# EAGLE design Shield-0.6 (EAGLE 7.6.0)
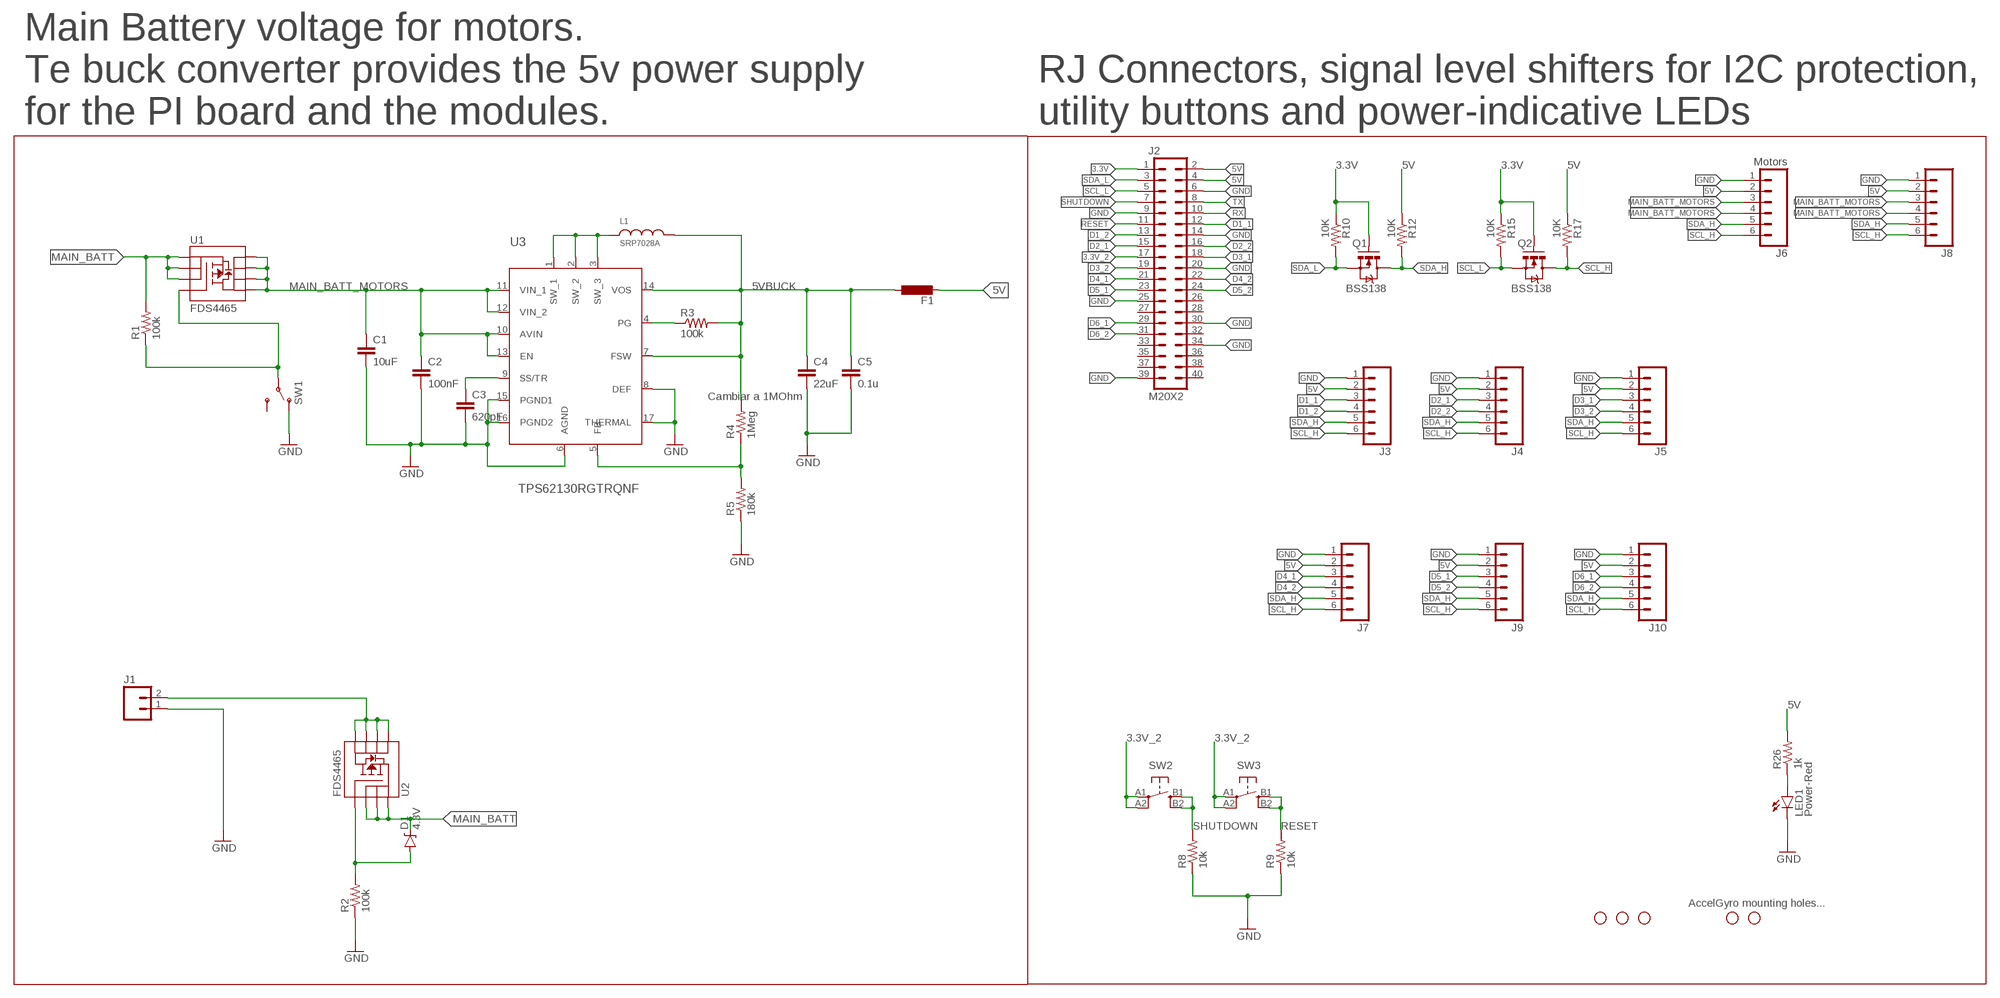
[diagram p0: schematic, sheet 1]

## Parts
C1  10uF  CAP0603-CAP  [0603-CAP]
C2  100nF  CAP0603-CAP  [0603-CAP]
C3  620pF  CAP0603-CAP  [0603-CAP]
C4  22uF  CAP0805  [0805]
C5  0.1u  CAP0603-CAP  [0603-CAP]
D1  4.3V  DIODE-ZENER3.3V  [SOD-323]
F1  L-EUL1812  [L1812]
H1  STAND-OFFPLATED  [STAND-OFF-PLATED]
H2  STAND-OFFPLATED  [STAND-OFF-PLATED]
H3  STAND-OFFNORMAL  [STAND-OFF]
H4  STAND-OFF  [STAND-OFF]
H5  STAND-OFF  [STAND-OFF]
J1  M02PTH-XH  [JST-2-PTH-XH]
J2  M20X2  [2X20]
J3  M06RJ11  [RJ11-6P6C]
J4  M06RJ11  [RJ11-6P6C]
J5  M06RJ11  [RJ11-6P6C]
J6  Motors  M06RJ11  [RJ11-6P6C]
J7  M06RJ11  [RJ11-6P6C]
J8  M06RJ11  [RJ11-6P6C]
J9  M06RJ11-SMD  [RJ11-6P6C-SMD]
J10  M06RJ11-SMD  [RJ11-6P6C-SMD]
L1  SRP7028A  [SRP7028A]
LED1  Power-Red  LED0603  [LED-0603]
Q1  BSS138  MOSFET-NCHANNELSMD  [SOT23-3]
Q2  BSS138  MOSFET-NCHANNELSMD  [SOT23-3]
R1  100k  RESISTOR0603-RES  [0603-RES]
R2  100k  RESISTOR0603-RES  [0603-RES]
R3  100k  RESISTOR0603-RES  [0603-RES]
R4  1Meg  RESISTOR0603-RES  [0603-RES]
R5  180k  RESISTOR0603-RES  [0603-RES]
R8  10k  RESISTOR0603-RES  [0603-RES]
R9  10k  RESISTOR0603-RES  [0603-RES]
R10  10K  RESISTOR0603-RES  [0603-RES]
R12  10K  RESISTOR0603-RES  [0603-RES]
R15  10K  RESISTOR0603-RES  [0603-RES]
R17  10K  RESISTOR0603-RES  [0603-RES]
R26  1k  RESISTOR0603-RES  [0603-RES]
SW1  SWITCH-SPDT-SPDT-TH  [SW-SPDT-TH]
SW2  SWITCH_SPST_4_PINTALL  [TACTILE_SWITCH_TALL]
SW3  SWITCH_SPST_4_PINTALL  [TACTILE_SWITCH_TALL]
U1  FDS4465  MOSFET-PCHANNEL-SOIC8SOIC8  [SO08]
U2  FDS4465  MOSFET-PCHANNEL-SOIC8SOIC8  [SO08]
U3  TPS62130RGTRQNF  [QFN-N16]

## Nets
3.3V: J2.1 Q1.1(G) Q2.1(G) R10.1 R15.1
3.3V_2: J2.17 SW2.A1 SW2.A2 SW3.A1 SW3.A2
5V: F1.2 J2.2 J2.4 J3.2 J4.2 J5.2 J6.2 J7.2 J8.2 J9.2 J10.2 R12.1 R17.1 R26.2
5VBUCK: C4.1 C5.1 F1.1 L1.P$2 R3.2 R4.2 U3.7(FSW) U3.14(VOS)
D1_1: J2.12 J3.3
D1_2: J2.13 J3.4
D2_1: J2.15 J4.3
D2_2: J2.16 J4.4
D3_1: J2.18 J5.3
D3_2: J2.19 J5.4
D4_1: J2.21 J7.3
D4_2: J2.22 J7.4
D5_1: J2.23 J9.3
D5_2: J2.24 J9.4
D6_1: J2.29 J10.3
D6_2: J2.31 J10.4
GND: C1.2 C2.2 C3.2 C4.2 C5.2 J1.1 J2.6 J2.9 J2.14 J2.20 J2.25 J2.30 J2.34 J2.39 J3.1 J4.1 J5.1 J6.1 J7.1 J8.1 J9.1 J10.1 LED1.C R2.1 R5.1 R8.1 R9.1 SW1.P$3(O) U3.6(AGND) U3.8(DEF) U3.15(PGND1) U3.16(PGND2) U3.17(THERMAL)
MAIN_BATT: D1.C R1.2 U1.1(S) U1.2(S) U1.3(S) U2.1(S) U2.2(S) U2.3(S)
MAIN_BATT_MOTORS: C1.1 C2.1 J6.3 J6.4 J8.3 J8.4 U1.5(D) U1.6(D) U1.7(D) U1.8(D) U3.10(AVIN) U3.11(VIN_1) U3.12(VIN_2) U3.13(EN)
MAIN_VBATT: J1.2 U2.5(D) U2.6(D) U2.7(D) U2.8(D)
N$1: C3.1 U3.9(SS/TR)
N$2: L1.P$1 U3.1(SW_1) U3.2(SW_2) U3.3(SW_3)
N$5: R3.1 U3.4(PG)
N$7: R4.1 R5.2 U3.5(FB)
N$15: LED1.A R26.1
N$17: D1.A R2.2 U2.4(G)
N$22: R1.1 SW1.P$2(P) U1.4(G)
RESET: J2.11 R9.2 SW3.B1 SW3.B2
RX: J2.10
SCL_H: J3.6 J4.6 J5.6 J6.6 J7.6 J8.6 J9.6 J10.6 Q2.3(D) R17.2
SCL_L: J2.5 Q2.2(S) R15.2
SDA_H: J3.5 J4.5 J5.5 J6.5 J7.5 J8.5 J9.5 J10.5 Q1.3(D) R12.2
SDA_L: J2.3 Q1.2(S) R10.2
SHUTDOWN: J2.7 R8.2 SW2.B1 SW2.B2
TX: J2.8
Unconnected: J2.26 J2.27 J2.28 J2.32 J2.33 J2.35 J2.36 J2.37 J2.38 J2.40 SW1.P$1(S)

## Notes on the sheet
- Main Battery voltage for motors.
  Te buck converter provides the 5v power supply 
  for the PI board and the modules.
- RJ Connectors, signal level shifters for I2C protection,  
  utility buttons and power-indicative LEDs
- Cambiar a 1MOhm
- AccelGyro mounting holes...

## Library data of the parts
C1-C3 C5 = SparkFun-Capacitors:CAP: Capacitor Standard 0603 ceramic capacitor, and 0.1" leaded capacitor.
C4 = SparkFun-Passives:CAP: Capacitor Standard 0603 ceramic capacitor, and 0.1" leaded capacitor.
D1 = SparkFun-DiscreteSemi:DIODE-ZENER: Zener Diode Production Part - 8199 3.4V Zener Voltage; PROD_ID: DIO-11284; VALUE: 3.3V
F1 = arduino_Uno_Rev3-02-TH:L-EU: INDUCTOR, European symbol
H1-H3 = Robotois:STAND-OFF: #4 Stand Off This is the mechanical footprint for a #4 phillips button head screw. Use the keepout ring to avoid running the screw head into surrounding components. SKU : PRT-00447
H4 H5 = SparkFun-Electromechanical:STAND-OFF: #4 Stand Off This is the mechanical footprint for a #4 phillips button head screw. Use the keepout ring to avoid running the screw head into surrounding components. SKU : PRT-00447
J1 = Robotois:M02: Standard 2-pin 0.1" header. Use with - straight break away headers ( PRT-00116) - right angle break away headers (PRT-00553) - swiss pins (PRT-00743) - machine pins (PRT-00117) - female headers (PRT-00115) Molex polarized connector foot print use with: PRT-08233 with associated crimp pins and housings. 2.54_SCREWTERM for use with PRT-10571. 3.5mm Screw Terminal footprints for PRT-08084 5mm Screw Terminal footprints for use with PRT-08432
J2 = SparkFun-Connectors:M20X2: 0.1" spaced headers
J3-J10 = Robotois:M06: Header 6 Standard 6-pin 0.1" header. Use with straight break away headers (SKU : PRT-00116), right angle break away headers (PRT-00553), swiss pins (PRT-00743), machine pins (PRT-00117), and female headers (PRT-00115). Molex polarized connector foot print use with SKU : PRT-08094 with associated crimp pins and housings. NOTES ON THE VARIANTS LOCK and LOCK_LONGPADS... This footprint was designed to help hold the alignment of a through-hole component (i.e. 6-pin header) while soldering it into place. You may notice that each hole has been shifted either up or down by 0.005 of an inch from it's more standard position (which is a perfectly straight line). This slight alteration caused the pins (the squares in the middle) to touch the edges of the holes. Because they are alternating, it causes a "brace" to hold the component in place. 0.005 has proven to be the perfect amount of "off-center" position when using our standard breakaway headers. Although looks a little odd when you look at the bare footprint, once you have a header in there, the alteration is very hard to notice. Also,if you push a header all the way into place, it is covered up entirely on the bottom side. This idea of altering the position of holes to aid alignment will be further integrated into the Sparkfun Library for other footprints. It can help hold any component with 3 or more connection pins.
L1 = Robotois:SRP7028A: This package is designed on the basis of the fixed inductor SRP7028A from Bourns.
LED1 = SparkFun-LED:LED: LEDs Standard schematic elements and footprints for 5mm, 3mm, 1206, and 0603 sized LEDs. 5mm - Spark Fun Electronics SKU : COM-00529 (and others)
Q1 Q2 = SparkFun:MOSFET-NCHANNEL
R1-R5 R8-R10 R12 R15 R17 R26 = SparkFun-Resistors:RESISTOR: Resistor Basic schematic elements and footprints for 0603, 1206, and PTH resistors.
SW1 = Robotois:SWITCH-SPDT: SPDT Switch Simple slide switch, Spark Fun Electronics SKU : COM-00102 DPDT SMT slide switch, AYZ0202, SWCH-08179
SW2 SW3 = Robotois:SWITCH_SPST_4_PIN
U1 U2 = SparkFun-DiscreteSemi:MOSFET-PCHANNEL-SOIC8: Generic 8-pin PMOSFET
U3 = Robotois:TPS62130RGTR

## Net classes
0 default: clearance 0.203 mm
1 vcc: clearance 0.254 mm

## Board
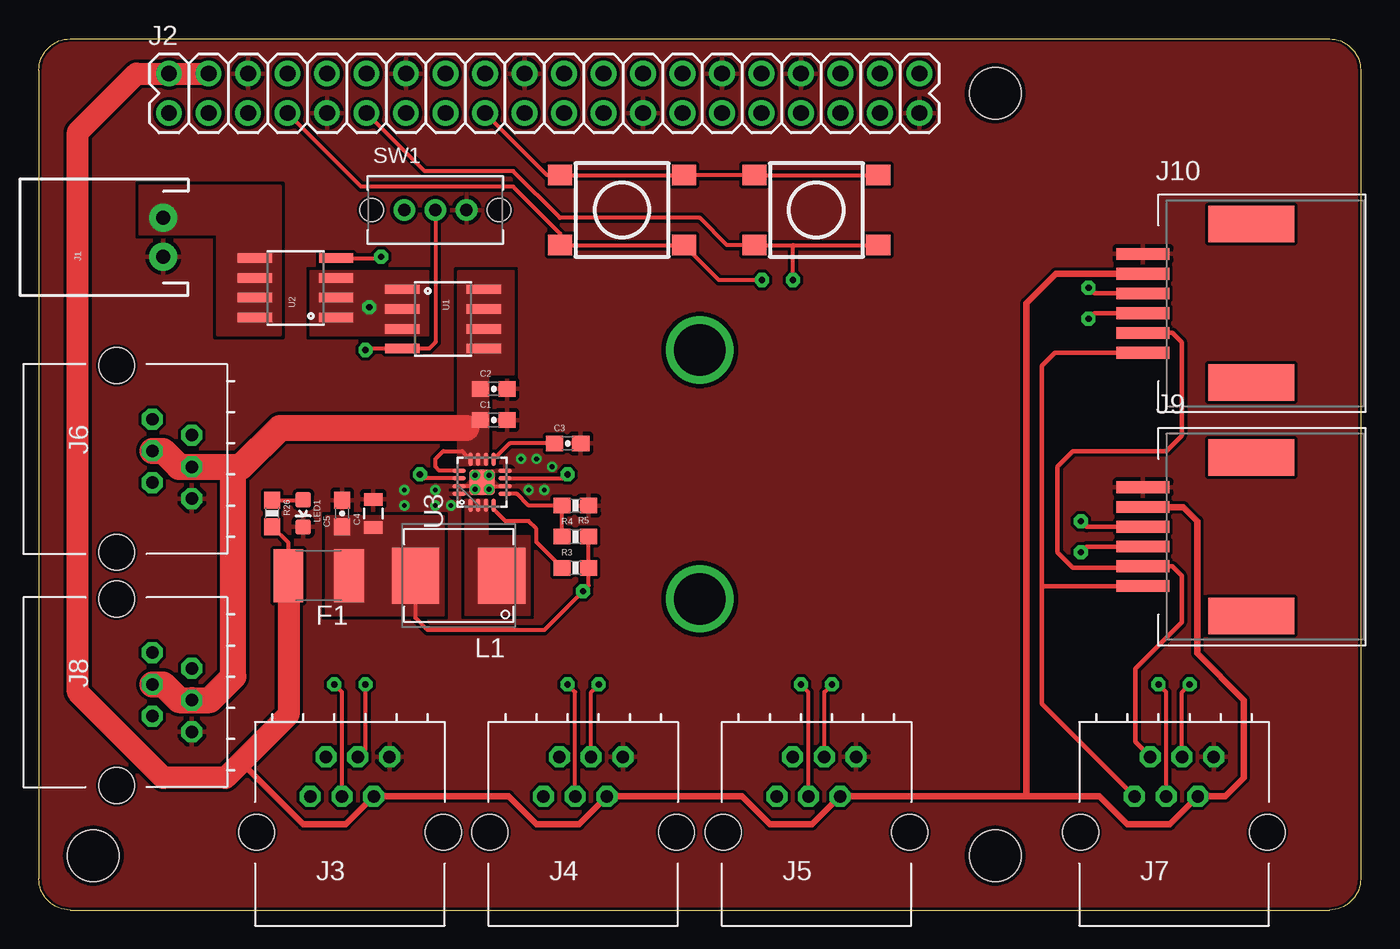
[diagram p1: board, top side]
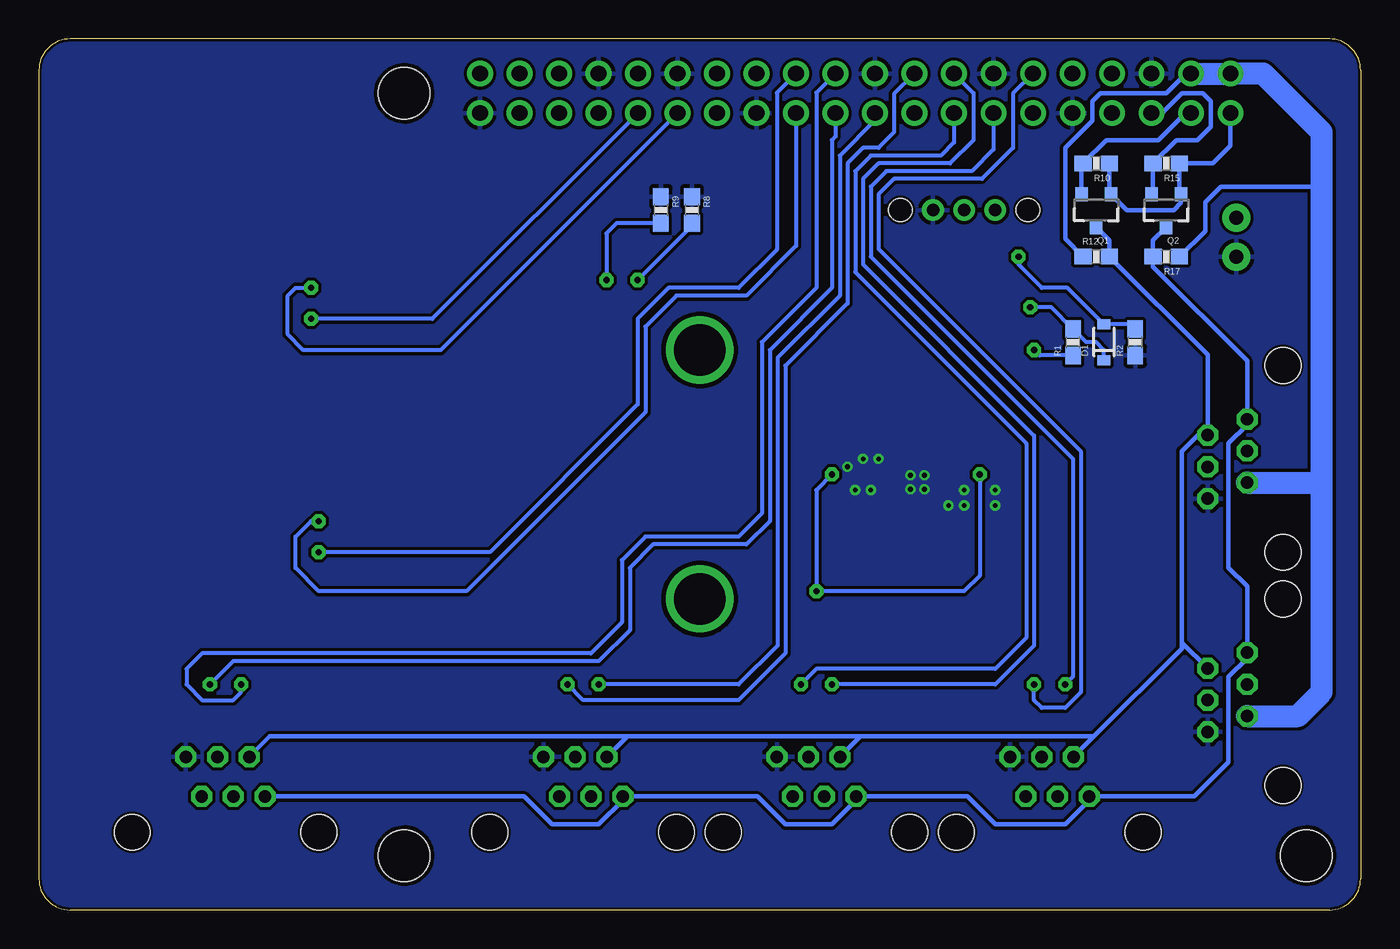
[diagram p2: board, bottom side, seen from below]

Size 85 x 56 mm. Coordinates in mm from the lower left corner, seen from the top.
Outline: 0,54 0,2 arc90 2,0 83,0 arc90 85,2 85,54 arc90 83,56 2,56 arc90 0,54
Copper layers (1*16): Top 0.035mm / dielectric 1.5mm / Bottom 0.035mm
Design rules "SparkFun-2-layer-TIGHT": minimum track width 7mil, minimum drill 15mil, track to track 7mil, track to pad 7mil, pad to pad 7mil, via to via 7mil, smd to smd 7mil, copper to edge 7mil, drill to drill 7mil, minimum pad ring 7mil, minimum via ring 7mil, stop-mask expansion 4mil, vias tented up to drill 25mil, thermal gap 10mil

### Footprints (pad centres in the part's own frame; a part is rotated, then mirrored left to right if it is on the bottom)
0603-CAP = smd 1.1 x 1: 1 -0.85,0; 2 0.85,0
0805 = smd 0.8 x 1.2: 1 -0.9,0; 2 0.9,0
SOD-323 = smd 0.63 x 0.83: A 1.15,0; C -1.15,0
L1812 = smd 1.9 x 3.4: 1 -1.95,0; 2 1.95,0
STAND-OFF-PLATED = drill 3.302: P$1 0,0
STAND-OFF = hole 3.302: 0,0
JST-2-PTH-XH = drill 0.9 pad 1.8: 1 0,0; 2 2.5,0
2X20 = drill 1.016 pad 1.651: 1 -24.13,-1.27; 2 -24.13,1.27; 3 -21.59,-1.27; 4 -21.59,1.27; 5 -19.05,-1.27; 6 -19.05,1.27; 7 -16.51,-1.27; 8 -16.51,1.27; 9 -13.97,-1.27; 10 -13.97,1.27; 11 -11.43,-1.27; 12 -11.43,1.27; 13 -8.89,-1.27; 14 -8.89,1.27; 15 -6.35,-1.27; 16 -6.35,1.27; 17 -3.81,-1.27; 18 -3.81,1.27; 19 -1.27,-1.27; 20 -1.27,1.27; 21 1.27,-1.27; 22 1.27,1.27; 23 3.81,-1.27; 24 3.81,1.27; 25 6.35,-1.27; 26 6.35,1.27; 27 8.89,-1.27; 28 8.89,1.27; 29 11.43,-1.27; 30 11.43,1.27; 31 13.97,-1.27; 32 13.97,1.27; 33 16.51,-1.27; 34 16.51,1.27; 35 19.05,-1.27; 36 19.05,1.27; 37 21.59,-1.27; 38 21.59,1.27; 39 24.13,-1.27; 40 24.13,1.27
RJ11-6P6C = drill 0.8 pad 1.35 octagon: 1 2.55,4.84; 2 1.53,2.3; 3 0.51,4.84; 4 -0.51,2.3; 5 -1.53,4.84; 6 -2.55,2.3 | hole 2.3: -6,0; 6,0
RJ11-6P6C-SMD = smd 3.4 x 0.76: 1 0,3.175; 2 0,1.905; 3 0,0.635; 4 0,-0.635; 5 0,-1.905; 6 0,-3.175 | smd 5.5 x 2.35: SR$1 6.97,5.1; SR$2 6.97,-5.1
SRP7028A = smd 3.05 x 3.6: P$1 -2.775,0; P$2 2.775,0
LED-0603 = smd 1 x 1: A 0,-0.877; C 0,0.877
SOT23-3 = smd 0.8 x 0.9: 1 -0.95,-1; 2 0.95,-1; 3 0,1.1
0603-RES = smd 1.1 x 1: 1 -0.85,0; 2 0.85,0
SW-SPDT-TH = drill 0.8 pad 1.4: P$1 -2,0; P$2 0,0; P$3 2,0 | hole 1.5: -4.1,0; 4.1,0
TACTILE_SWITCH_TALL = smd 1.55 x 1.3: A1 -3.975,-2.25; A2 3.975,-2.25; B1 -3.975,2.25; B2 3.975,2.25
SO08 = smd 0.61 x 2.21: 1 -1.905,-2.616; 2 -0.635,-2.616; 3 0.635,-2.616; 4 1.905,-2.616; 5 1.905,2.616; 6 0.635,2.616; 7 -0.635,2.616; 8 -1.905,2.616
QFN-N16 = smd 0.85 x 0.28: 1 -1.475,0.75; 2 -1.475,0.25; 3 -1.475,-0.25; 4 -1.475,-0.75; 9 1.475,-0.75; 10 1.475,-0.25; 11 1.475,0.25; 12 1.475,0.75 | smd 0.28 x 0.85: 5 -0.75,-1.475; 6 -0.25,-1.475; 7 0.25,-1.475; 8 0.75,-1.475; 13 0.75,1.475; 14 0.25,1.475; 15 -0.25,1.475; 16 -0.75,1.475 | smd 1.65 x 1.65: 17 0,0

### Placement (x,y rotation side)
C1  29.25,31.5 0 top
C2  29.25,33.5 0 top
C3  34,30 0 top
C4  21.5,25.5 90 top
C5  19.5,25.5 90 top
D1  16.5,36.5 90 bottom
F1  18,21.5 180 top
H1  42.5,20 0 top
H2  42.5,36 0 top
H3  61.5,52.5 0 top
H4  3.5,3.5 0 top
H5  61.5,3.5 0 top
J1  8,42 90 top
J2  32.5,52.5 0 top
J3  20,5 0 top
J4  35,5 0 top
J5  50,5 0 top
J6  5,29 270 top
J7  73,5 0 top
J8  5,14 270 top
J9  71,24 0 top
J10  71,39 0 top
L1  27,21.5 180 top
LED1  17,25.5 180 top
Q1  17,45 180 bottom
Q2  12.5,45 180 bottom
R1  18.5,36.5 90 bottom
R2  14.5,36.5 90 bottom
R3  34.5,22 0 top
R4  34.5,24 0 top
R5  34.5,26 180 top
R8  43,45 270 bottom
R9  45,45 270 bottom
R10  17,48 180 bottom
R12  17,42 0 bottom
R15  12.5,48 180 bottom
R17  12.5,42 180 bottom
R26  15,25.5 270 top
SW1  25.5,45 0 top
SW2  37.5,45 180 top
SW3  50,45 180 top
U1  26,38 270 top
U2  16.5,40 90 top
U3  28.5,27.5 90 top

### Tracks (layer width: path | path; a pad name or v marks a point on that pad's centre or on a via)
3.3V
  Bottom 0.254: 16.15,46.1 Q1.1 | 11.65,46.1 Q2.1
  Bottom 0.305: R10.1 16.15,46.1 | 11.65,46.1 R15.1 9.5,48 8.37,49.13 J2.1 | Q1.1 15.05,45 12,45 11.55,45.45 Q2.1
3.3V_2
  Top 0.254: J2.17 32.67,47.25 SW2.A2 SW2.A1 SW3.A2 SW3.A1
5V
  Top 0.254: F1.2 16.05,23.6 R26.2
  Top 0.406: 13,9.5 17,5.5 19.73,5.5 J3.2 30.2,7.3 32,5.5 34.73,5.5 J4.2 45.2,7.3 47,5.5 49.73,5.5 J5.2 63.5,7.3 | 63.5,7.3 68.2,7.3 70,5.5 72.73,5.5 J7.2 76.3,7.3 77.5,8.5 77.5,13.5 74.5,16.5 74.5,25 73.59,25.91 J9.2 | J10.2 65.41,40.91 63.5,39 63.5,7.3
  Top 1.422: J2.4 J2.2 6.27,53.77 2.5,50 2.5,14 8,8.5 12,8.5 13,9.5 16.05,12.55 F1.2
  Bottom 0.305: R17.1 10,43.65 10,45.5 9,46.5 2.5,46.5 | R12.1 19,43.15 19,49 17.25,50.75 17.25,52 16.75,52.5 12.5,52.5 11.23,53.77 J2.4
  Bottom 1.422: J6.2 2.53,27.47 2.5,27.5 | 2.5,27.5 2.5,14 4.03,12.47 J8.2 | 2.5,27.5 2.5,46.5 2.5,50 6.27,53.77 J2.2 J2.4
5VBUCK  (via drill 0.4 pad 0.9)
  Top 0.254: R4.2 R3.2 35.35,20.85 v35,20.5 32.5,18 25,18 24.23,18.77 L1.P$2 | U3.14 24.75,27.75 v24.5,28 | U3.7 33.75,27.75 v34,28
  Bottom 0.254: v34,28 35,27 v35,20.5 25.5,20.5 24.5,21.5 v24.5,28
  pour Top (no thermals): 26,19 26,25.25 18.5,25.25 18.5,19
D1_1  (via drill 0.4 pad 0.9)
  Top 0.254: J3.3 21,10.33 v21,14.5
  Bottom 0.254: J2.12 22.35,52.49 22.35,49 24.35,47 30,47 31,46 31,42.5 18,29.5 18,14 19,13 20.5,13 21,13.5 v21,14.5
D1_2  (via drill 0.4 pad 0.9)
  Top 0.254: J3.4 19.49,14.01 v19,14.5
  Bottom 0.254: J2.13 23.61,48.89 25,47.5 30.5,47.5 31.5,46.5 31.5,42 18.5,29 18.5,15 v19,14.5
D2_1  (via drill 0.4 pad 0.9)
  Top 0.254: J4.3 35.51,14.01 v36,14.5
  Bottom 0.254: J2.15 26.15,49.35 27,48.5 31.5,48.5 32.5,47.5 32.5,41 21.5,30 21.5,17.5 23.5,15.5 35,15.5 v36,14.5
D2_2  (via drill 0.4 pad 0.9)
  Top 0.254: J4.4 34.49,14.01 v34,14.5
  Bottom 0.254: J2.16 24.9,52.52 24.9,49.5 26.4,48 31,48 32,47 32,41.5 21,30.5 21,17 23.5,14.5 v34,14.5
D3_1  (via drill 0.4 pad 0.9)
  Top 0.254: J5.3 50.51,14.01 v51,14.5
  Bottom 0.254: J2.18 30,52.46 30,50 31,49 32,49 33,48 33,39 37,35 37,16.5 40,13.5 50,13.5 v51,14.5
D3_2  (via drill 0.4 pad 0.9)
  Top 0.254: J5.4 49.49,14.01 v49,14.5
  Bottom 0.254: v49,14.5 40,14.5 37.5,17 37.5,35.5 33.5,39.5 33.5,48.5 31.23,50.77 J2.19
D4_1  (via drill 0.4 pad 0.9)
  Top 0.254: J7.3 73.51,14.01 v74,14.5
  Bottom 0.254: J2.21 33.77,49.73 34,49.5 34,40 38,36 38,25 39.5,23.5 45.5,23.5 47,22 47,18 49,16 72.5,16 v74,14.5
D4_2  (via drill 0.4 pad 0.9)
  Top 0.254: J7.4 72.49,14.01 v72,14.5
  Bottom 0.254: J2.22 35,52.54 35,40 38.5,36.5 38.5,25.5 40,24 46,24 47.5,22.5 47.5,18.5 49.5,16.5 74.5,16.5 75.5,15.5 75.5,14.5 74.5,13.5 72.5,13.5 72,14 v72,14.5
D5_1  (via drill 0.4 pad 0.9)
  Top 0.305: J9.3 67.36,24.64 v67,25
  Bottom 0.254: v67,25 67.5,25 68.5,24 68.5,22 67,20.5 57.5,20.5 46,32 46,37.5 44,39.5 39.5,39.5 36.31,42.69 J2.23
D5_2  (via drill 0.4 pad 0.9)
  Top 0.305: J9.4 67.36,23.36 v67,23
  Bottom 0.254: J2.24 37.55,52.53 37.55,42.45 40,40 44.5,40 46.5,38 46.5,32.5 56,23 v67,23
D6_1  (via drill 0.4 pad 0.9)
  Top 0.305: J10.3 67.86,39.63 v67.5,40
  Bottom 0.254: J2.29 59.16,36 68,36 69,37 69,39.5 68.5,40 v67.5,40
D6_2  (via drill 0.4 pad 0.9)
  Top 0.305: J10.4 67.86,38.37 v67.5,38
  Bottom 0.254: J2.31 59.7,38 v67.5,38
GND  (via drill 0.3)
  Top 0.254: U3.15 28.25,27.25 U3.17 28.75,27.25 U3.6
  other vias: 25.5,27 25.5,26 26.5,26 31,29 32,29 33,28.5 32.5,27 31.5,27 23.5,27 23.5,26 28.05,27.95 28.95,27.95 28.95,27.05 28.05,27.05
  pour Bottom (rank 2): -2,58 -2,-2 88,-2 88,58
  pour Top (rank 2): -4,60 -4,-4 90,-4 90,60
MAIN_BATT  (via drill 0.4 pad 0.9)
  Bottom 0.254: D1.C 16.5,36 17,36.5 17.65,36.5 R1.2 19.9,38.75 v21.25,38.75
  pour Top (no thermals): 17.5,41 17.5,37 25,37 25,41
MAIN_BATT_MOTORS
  Top 0.254: U3.13 25.75,28.25 25.5,28.5 25.5,29 26,29.5 27.23,29.5 U3.12
  Top 1.676: 12.5,28.49 J6.3 9.01,28.49 7.99,29.51 J6.4 | 12.5,28.49 12.99,28.49 15.5,31 27.5,31 | 12.5,28.49 12.5,15 10.99,13.49 J8.3 9.01,13.49 7.99,14.51 J8.4
  pour Top (no thermals): 27,41 27,28.65 28.85,28.65 28.85,34.5 30.5,34.5 30.5,41
MAIN_VBATT
  pour Top (no thermals): 6.5,43.5 11.5,43.5 11.5,37 15.5,37 15.5,46.5 6.5,46.5
N$1
  Top 0.254: C3.1 30.27,30 U3.9
N$2
  pour Top (no thermals): 28.8,26.35 28.8,24 31.5,24 31.5,19 27.5,19 27.5,26.3 27.5,26.35
N$5
  Top 0.254: R3.1 32,23.65 32,24.5 31.5,25 30,25 29.25,25.75 U3.4
N$7
  Top 0.254: U3.5 30.75,26.75 31.5,26 R5.2 R4.1
N$15
  Top 0.254: R26.1 16.97,26.35 LED1.A
N$17  (via drill 0.4 pad 0.9)
  Top 0.254: U2.4 21.91,41.91 v22,42
  Bottom 0.254: R2.2 14.8,37.65 D1.A 18.85,40 20.5,40 22,41.5 v22,42
N$22  (via drill 0.4 pad 0.9)
  Top 0.254: v21,36 21.09,36.09 U1.4 25.09,36.09 25.5,36.5 SW1.P$2
  Bottom 0.254: R1.1 20.65,35.65 v21,36
RESET  (via drill 0.4 pad 0.9)
  Top 0.254: J2.11 24.8,47.5 30.5,47.5 33.5,44.5 42.5,44.5 44.25,42.75 SW3.B2 48.5,42.75 | 48.5,42.75 SW3.B1 | v48.5,40.5 48.5,42.75
  Bottom 0.254: R9.2 47.85,44.15 48.5,43.5 v48.5,40.5
SCL_H
  Top 0.305: J10.6 65.33,35.83 64.5,35 64.5,20.9 | 64.5,20.9 64.5,13.25 J7.6 | J9.6 64.58,20.82 64.5,20.9
  Bottom 0.305: Q2.3 13.35,43.05 R17.2 13.35,41.35 7.3,35.3 J6.6 7.3,31.2 8.5,30 8.5,22 7.3,20.8 J8.6 7.3,16.2 8.5,15 8.5,9.5 10.7,7.3 J3.6 17.45,7.05 19,5.5 23.5,5.5 25.3,7.3 J4.6 32.45,7.05 34,5.5 37,5.5 38.8,7.3 J5.6 47.45,7.05 49,5.5 52,5.5 53.8,7.3 J7.6
SCL_L
  Bottom 0.254: 13.35,46.1 Q2.2
  Bottom 0.305: 13.35,46.1 R15.2 11.85,49.5 10.5,49.5 9.65,50.35 9.65,52 10.15,52.5 11.5,52.5 12.77,51.23 J2.5
SDA_H
  Top 0.305: J7.5 70.5,10.81 70.5,15.5 73.5,18.5 73.5,21.5 72.91,22.09 J9.5 70.91,22 66.5,22 65.5,23 65.5,28.5 66.5,29.5 72.5,29.5 73.5,30.5 73.5,36.5 72.91,37.09 J10.5
  Bottom 0.254: J7.5 70.16,11.15
  Bottom 0.305: Q1.3 16.15,43.05 R12.2 9.84,35.69 J6.5 10.47,30.53 11.5,29.5 11.5,17.19 | J8.5 11.5,17.19 | J3.5 17.16,11.15 | 17.16,11.15 11.5,16.81 11.5,17.19 | J4.5 32.16,11.15 | 32.16,11.15 17.16,11.15 | J5.5 47.16,11.15 | 47.16,11.15 32.16,11.15 | 70.16,11.15 47.16,11.15
SDA_L
  Bottom 0.254: 11.27,51.23 J2.3
  Bottom 0.305: Q1.2 17.95,47.9 R10.2 16.35,49.5 13,49.5 11.27,51.23
SHUTDOWN  (via drill 0.4 pad 0.9)
  Top 0.254: J2.7 20.72,46.5 30.5,46.5 33.52,43.48 SW2.B2 SW2.B1 43.73,40.5 v46.5,40.5
  Bottom 0.254: R8.2 43,44 v46.5,40.5